# EAGLE schematic MotorController (EAGLE 7.1.0)
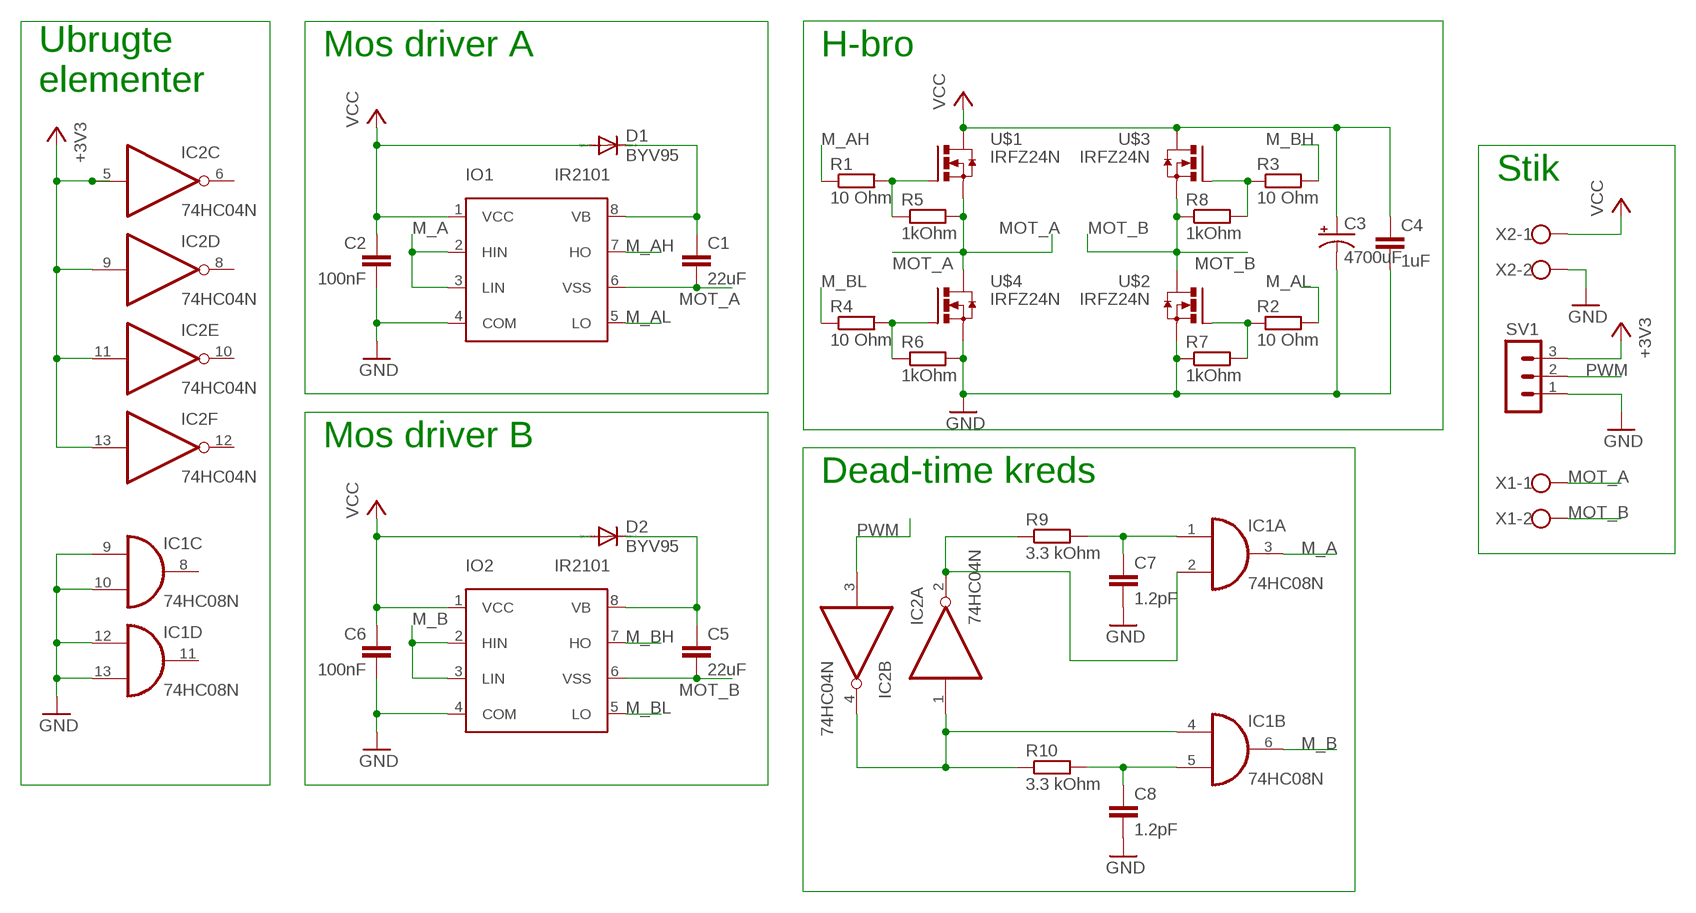
[diagram p0: schematic, sheet 1]

## Parts
C1  22uF  CAPPTH1  [CAP-PTH-5MM]
C2  100nF  CAPPTH1  [CAP-PTH-5MM]
C3  4700uF  CAP_POLPTH4  [CPOL-RADIAL-1000UF-25V]
C4  1uF  CAPPTH1  [CAP-PTH-5MM]
C5  22uF  CAPPTH1  [CAP-PTH-5MM]
C6  100nF  CAPPTH1  [CAP-PTH-5MM]
C7  1.2pF  CAPPTH1  [CAP-PTH-5MM]
C8  1.2pF  CAPPTH1  [CAP-PTH-5MM]
D1  BYV95  [SOD57-10]
D2  BYV95  [SOD57-10]
IC1  74HC08N  [DIL14]
IC2  74HC04N  [DIL14]
IO1  IR2101  [DIL08]
IO2  IR2101  [DIL08]
R1  10 Ohm  R-EU_0207/10  [0207/10]
R2  10 Ohm  R-EU_0207/10  [0207/10]
R3  10 Ohm  R-EU_0207/10  [0207/10]
R4  10 Ohm  R-EU_0207/10  [0207/10]
R5  1kOhm  R-EU_0207/10  [0207/10]
R6  1kOhm  R-EU_0207/10  [0207/10]
R7  1kOhm  R-EU_0207/10  [0207/10]
R8  1kOhm  R-EU_0207/10  [0207/10]
R9  3.3 kOhm  R-EU_0207/10  [0207/10]
R10  3.3 kOhm  R-EU_0207/10  [0207/10]
SV1  MA03-1  [MA03-1]
U$1  IRFZ24N  [TO220BH]
U$2  IRFZ24N  [TO220BH]
U$3  IRFZ24N  [TO220BH]
U$4  IRFZ24N  [TO220BH]
X1  W237-102  [W237-102]
X2  W237-102  [W237-102]

## Nets
+3V3: IC2.5(C:I) IC2.9(D:I) IC2.11(E:I) IC2.13(F:I) SV1.3
GND: C2.2 C3.2(-) C4.2 C6.2 C7.2 C8.2 IC1.9(C:I0) IC1.10(C:I1) IC1.12(D:I0) IC1.13(D:I1) IO1.4(COM) IO2.4(COM) R6.2 R7.1 SV1.1 U$2.S U$4.S X2.2
M_A: IC1.3(A:O) IO1.2(HIN) IO1.3(LIN)
M_AH: IO1.7(HO) R1.1
M_AL: IO1.5(LO) R2.2
M_B: IC1.6(B:O) IO2.2(HIN) IO2.3(LIN)
M_BH: IO2.7(HO) R3.2
M_BL: IO2.5(LO) R4.1
MOT_A: C1.2 IO1.6(VSS) R5.2 U$1.S U$4.D X1.1
MOT_B: C5.2 IO2.6(VSS) R8.1 U$2.D U$3.S X1.2
N$2: C5.1 D2.C IO2.8(VB)
N$3: R1.2 R5.1 U$1.G
N$4: R4.2 R6.1 U$4.G
N$5: R3.1 R8.2 U$3.G
N$6: R2.1 R7.2 U$2.G
N$8: C1.1 D1.C IO1.8(VB)
N$10: IC1.4(B:I0) IC2.1(A:I) IC2.4(B:O) R10.1
N$15: C7.1 IC1.1(A:I0) R9.2
N$16: C8.1 IC1.5(B:I1) R10.2
PWM: IC1.2(A:I1) IC2.2(A:O) IC2.3(B:I) R9.1 SV1.2
VCC: C2.1 C3.1(+) C4.1 C6.1 D1.A D2.A IO1.1(VCC) IO2.1(VCC) U$1.D U$3.D X2.1
Unconnected: IC1.8(C:O) IC1.11(D:O) IC2.6(C:O) IC2.8(D:O) IC2.10(E:O) IC2.12(F:O)

## Notes on the sheet
- Mos driver A | H-bro
- Ubrugte
  elementer
- Stik
- Mos driver B
- Dead-time kreds

## Power pins joined to a net without a drawn wire
GND: IC1.7(P:GND) IC2.7(P:GND)
VCC: IC1.14(P:VCC) IC2.14(P:VCC)

## Library data of the parts
C1 C2 C4-C8 = SparkFun-Passives:CAP: Capacitor Standard 0603 ceramic capacitor, and 0.1" leaded capacitor.
C3 = SparkFun-Passives:CAP_POL: Capacitor Polarized These are standard SMD and PTH capacitors. Normally 10uF, 47uF, and 100uF in electrolytic and tantalum varieties. Always verify the external diameter of the through hole cap, it varies with capacity, voltage, and manufacturer. The EIA devices should be standard.
D1 D2 = diode:BYV95: DIODE fast soft-recovery controlled avalanche rectifier
IC1 = 74xx-eu:74*08: Quad 2-input AND gate
IC2 = 74xx-eu:74*04: Hex INVERTER
IO1 IO2 = drivers:IR2101: IR2101 HIGH AND LOW SIDE DRIVER Product Summary VOFFSET 600V max. IO+/- 130 mA / 270 mA VOUT 10 - 20V ton/off (typ.) 160 & 150 ns Delay Matching 50 ns IR2101(S)/IR2102(S) & (PbF) Features ? Floating channel designed for bootstrap operation Fully operational to +600V Tolerant to negative transient voltage dV/dt immune ? Gate drive supply range from 10 to 20V ? Undervoltage lockout ? 3.3V, 5V, and 15V logic input compatible ? Matched propagation delay for both channels ? Outputs in phase with inputs (IR2101) or out of phase with inputs (IR2102) ? Also available LEAD-FREE Description The IR2101(S)/IR2102(S) are high voltage, high speed power MOSFET and IGBT drivers with independent high and low side referenced output channels. Proprietary HVIC and latch immune CMOS technologies enable ruggedized monolithic construction. The logic input is compatible with standard CMOS or LSTTL output, down to 3.3V logic. The output drivers feature a high pulse current buffer stage designed for minimum driver cross-conduction. The floating channel can be used to drive an N-channel power MOSFET or IGBT in the high side configuration which operates up to 600 volts.
R1-R10 = rcl:R-EU_: RESISTOR, European symbol
SV1 = con-lstb:MA03-1: PIN HEADER; OC_FARNELL: unknown; OC_NEWARK: unknown
U$1-U$4 = transistor-power:IRFZ24N: International rectifier 55V, 0,07Ohm, 17A, Power HEXFET
X1 X2 = con-wago-500:W237-102: WAGO SCREW CLAMP; MPN: 237-102; OC_FARNELL: unknown; OC_NEWARK: 70K9898